# EAGLE design Horn_board_v2.1 (EAGLE 9.6.2)
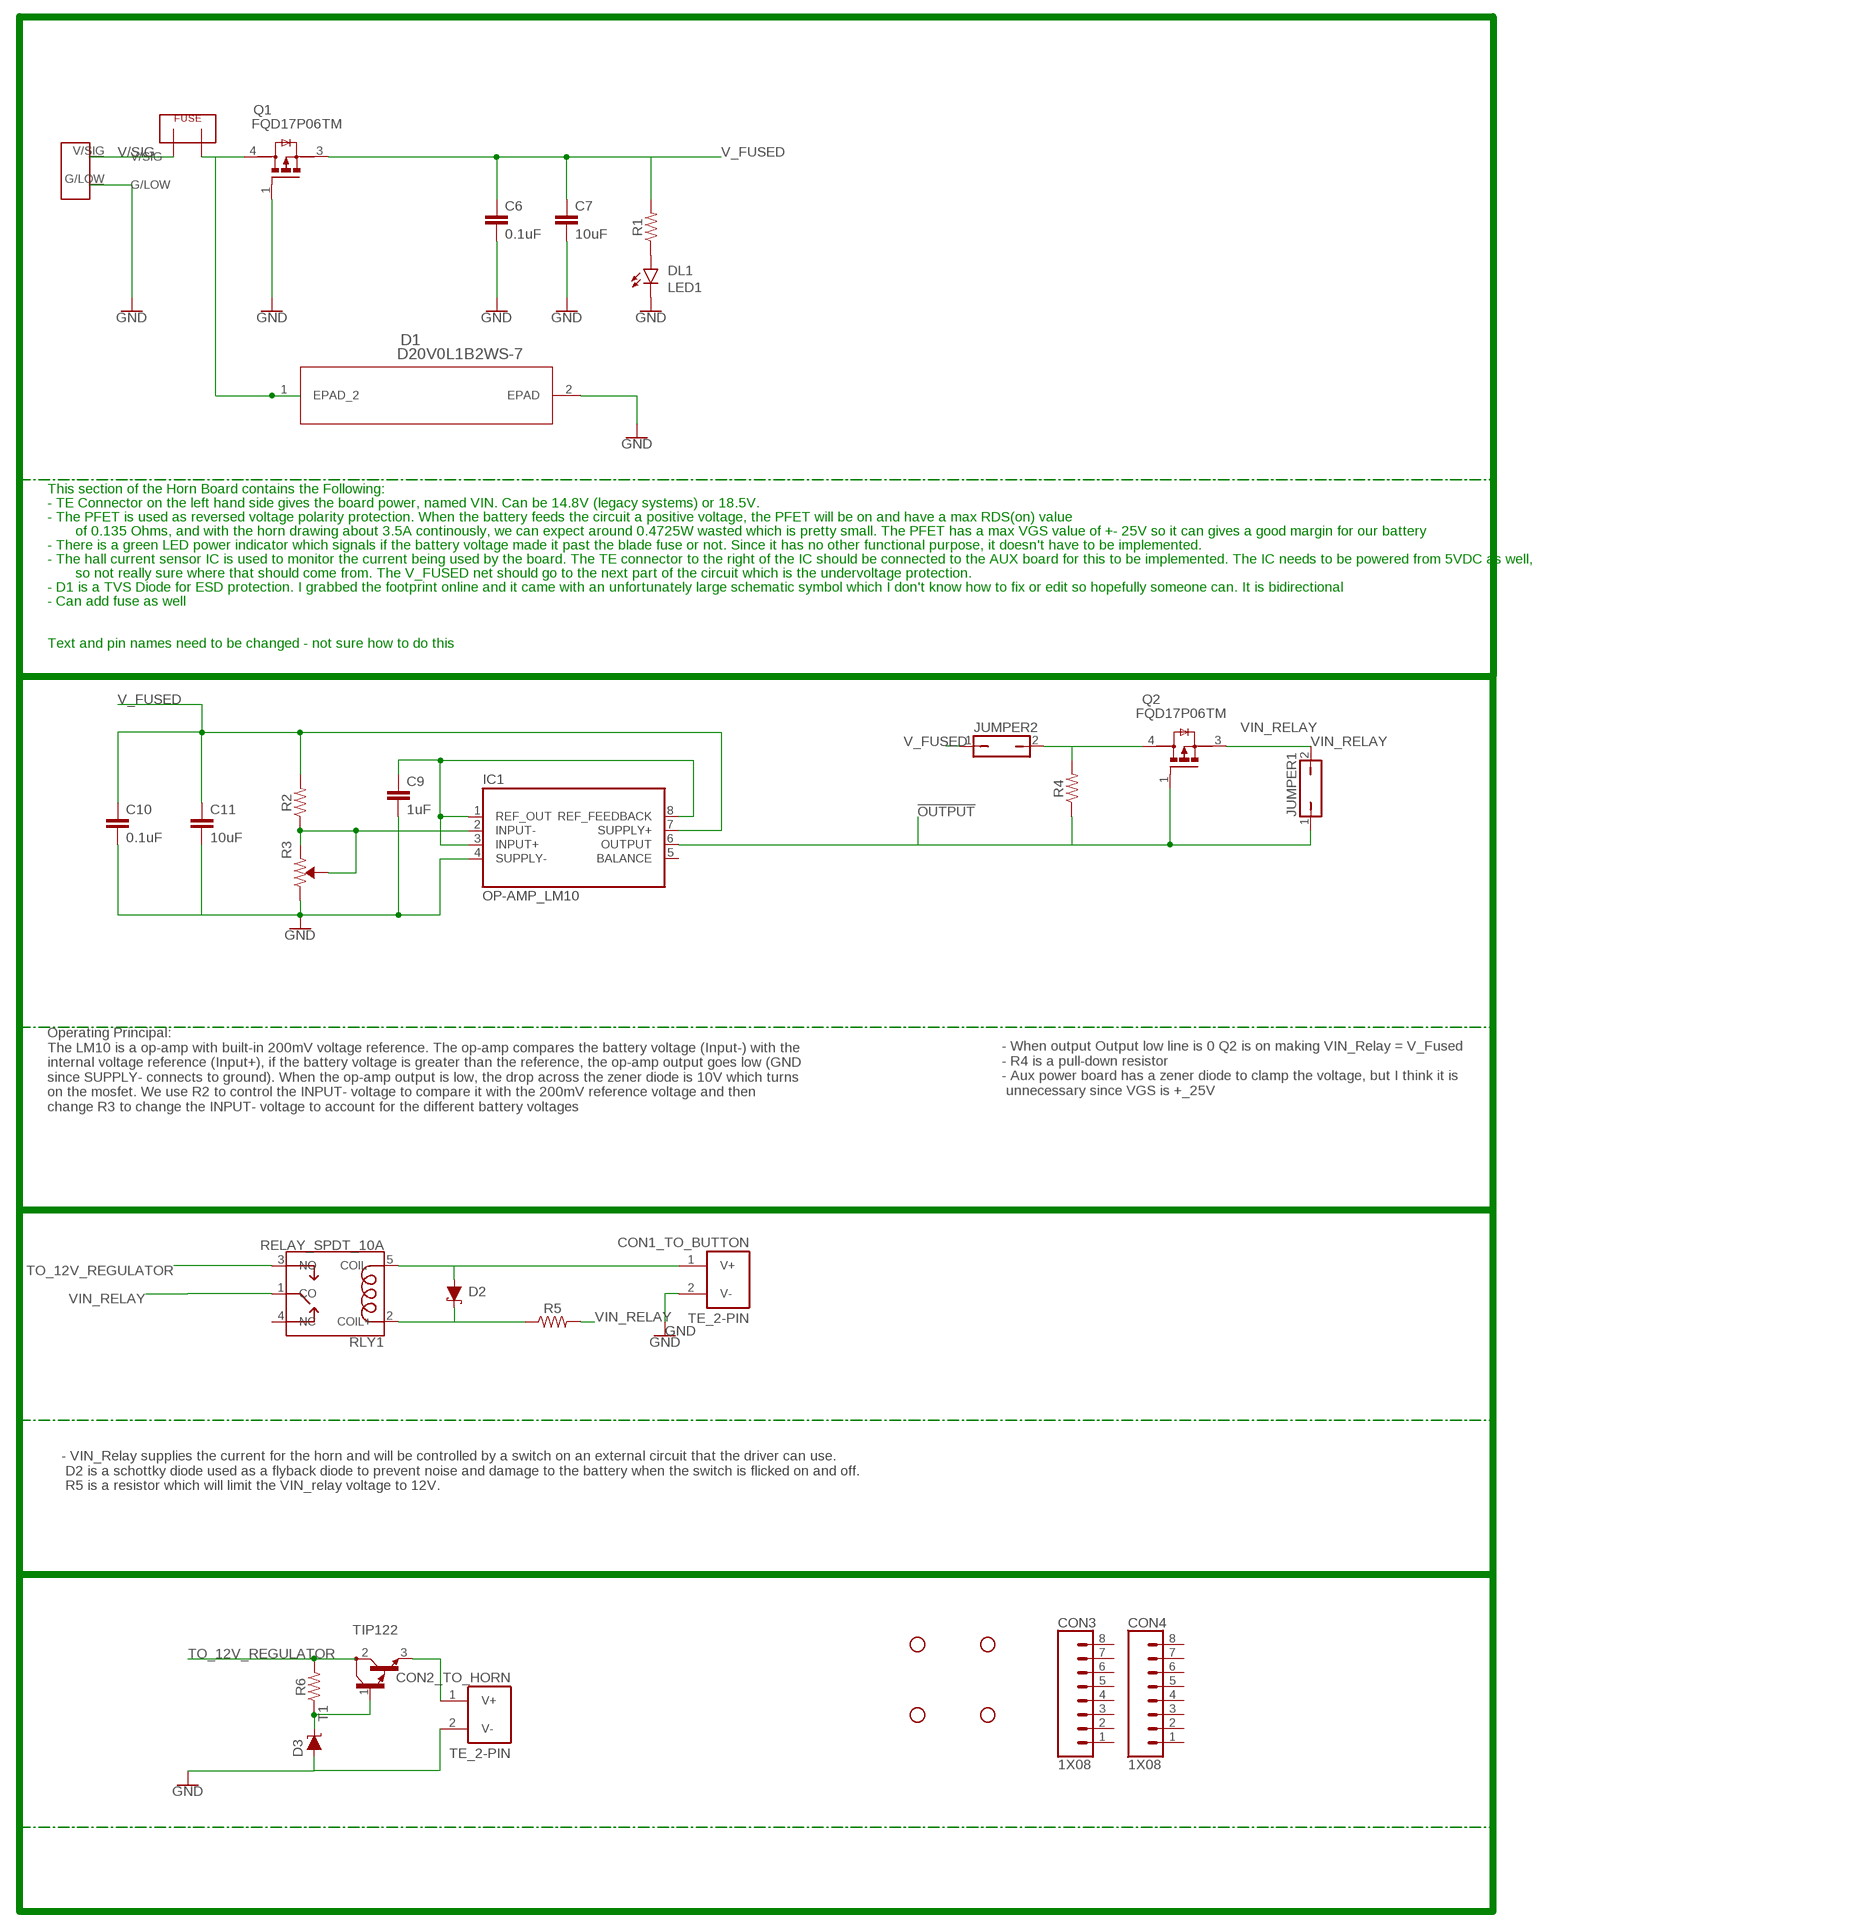
[diagram p0: schematic, sheet 1]

## Parts
C6  0.1uF  CAPACITOR_1210  [1210]
C7  10uF  CAPACITOR_1210  [1210]
C9  1uF  CAPACITOR_1210  [1210]
C10  0.1uF  CAPACITOR_1210  [1210]
C11  10uF  CAPACITOR_1210  [1210]
CON1_TO_BUTTON  TE_2-PIN  [TE_2-PIN]
CON2_TO_HORN  TE_2-PIN  [TE_2-PIN]
CON3  1X08  [1X08]
CON4  1X08  [1X08]
D1  D20V0L1B2WS-7  [SOD323_DIO]
D2  DIODE_SCHOTTKY_DO-214AA  [DO214AA]
D3  DIODE_TVS_DO-214AA  [DO214AA]
F2  FUSEMINI-BLADE  [MINI-BLADE-FUSE]
H1  STAND-OFF  [STAND-OFF]
H2  STAND-OFF  [STAND-OFF]
H3  STAND-OFF  [STAND-OFF]
H4  STAND-OFF  [STAND-OFF]
IC1  OP-AMP_LM10  [DIP08]
JUMPER1  JP1Q  [JP1]
JUMPER2  JP1Q  [JP1]
LED1  DL1  LED_0805  [0805_LED]
POWER_IN  2_PIN_TECONNECTOR  [2_PIN_CONNECT]
Q1  FQD17P06TM  [DPAK229P990X239-4N]
Q2  FQD17P06TM  [DPAK229P990X239-4N]
R1  RESISTOR_1210  [1210]
R2  RESISTOR_1210  [1210]
R3  RESISTOR_TRIMPOT  [TRIMPOT]
R4  RESISTOR_1210  [1210]
R5  RESISTOR_1210  [1210]
R6  RESISTOR_1210  [1210]
RLY1  RELAY_SPDT_10A  [RELAY_SPDT_10A]
T1  TIP122  [TO220]

## Nets
!OUTPUT: IC1.6(OUTPUT) JUMPER1.1 Q2.1(G) R4.1
GND: C6.2 C7.2 C10.2 C11.2 CON1_TO_BUTTON.2(V-) CON2_TO_HORN.2(V-) D1.2(EPAD) D3.A LED1.2(C) POWER_IN.G/LOW Q1.1(G) R3.3(CW)
N$2: C9.2 IC1.4(SUPPLY-)
N$4: RLY1.1(CO)
N$5: LED1.1(A) R1.1
N$6: IC1.2(INPUT-) R2.1 R3.1(CCW) R3.2(WIPER)
N$8: C9.1 IC1.1(REF_OUT) IC1.3(INPUT+) IC1.8(REF_FEEDBACK)
N$9: JUMPER2.2 Q2.4(D) R4.2
N$10: D2.C R5.1 RLY1.2(COIL+)
N$11: CON1_TO_BUTTON.1(V+) D2.A RLY1.5(COIL-)
N$13: D3.C R6.1 T1.1(B)
N$14: CON2_TO_HORN.1(V+) T1.3(E)
TO_12V_REGULATOR: R6.2 RLY1.3(NO) T1.2(C)
V/SIG: F2.OUT POWER_IN.V/SIG
V_FUSED: C6.1 C7.1 C10.1 C11.1 IC1.7(SUPPLY+) JUMPER2.1 Q1.3(S) R1.2 R2.2
VIN: D1.1(EPAD_2) F2.IN Q1.4(D)
VIN_RELAY: JUMPER1.2 Q2.3(S) R5.2
Unconnected: CON3.1 CON3.2 CON3.3 CON3.4 CON3.5 CON3.6 CON3.7 CON3.8 CON4.1 CON4.2 CON4.3 CON4.4 CON4.5 CON4.6 CON4.7 CON4.8 IC1.5(BALANCE) RLY1.4(NC)

## Notes on the sheet
- This section of the Horn Board contains the Following:
- - TE Connector on the left hand side gives the board power, named VIN. Can be 14.8V (legacy systems) or 18.5V.
- - The PFET is used as reversed voltage polarity protection. When the battery feeds the circuit a positive voltage, the PFET will be on and have a max RDS(on) value
- of 0.135 Ohms, and with the horn drawing about 3.5A continously, we can expect around 0.4725W wasted which is pretty small. The PFET has a max VGS value of +- 25V so it can gives a good margin for our battery
- - There is a green LED power indicator which signals if the battery voltage made it past the blade fuse or not. Since it has no other functional purpose, it doesn't have to be implemented.
- - The hall current sensor IC is used to monitor the current being used by the board. The TE connector to the right of the IC should be connected to the AUX board for this to be implemented. The IC needs to be powered from 5VDC as well,
- so not really sure where that should come from. The V_FUSED net should go to the next part of the circuit which is the undervoltage protection.
- - D1 is a TVS Diode for ESD protection. I grabbed the footprint online and it came with an unfortunately large schematic symbol which I don't know how to fix or edit so hopefully someone can. It is bidirectional
- - Can add fuse as well
- Text and pin names need to be changed - not sure how to do this
- - When output Output low line is 0 Q2 is on making VIN_Relay = V_Fused
  - R4 is a pull-down resistor 
  - Aux power board has a zener diode to clamp the voltage, but I think it is
   unnecessary since VGS is +_25V
- Operating Principal: 
  The LM10 is a op-amp with built-in 200mV voltage reference. The op-amp compares the battery voltage (Input-) with the 
  internal voltage reference (Input+), if the battery voltage is greater than the reference, the op-amp output goes low (GND 
  since SUPPLY- connects to ground). When the op-amp output is low, the drop across the zener diode is 10V which turns 
  on the mosfet. We use R2 to control the INPUT- voltage to compare it with the 200mV reference voltage and then 
  change R3 to change the INPUT- voltage to account for the different battery voltages
- - VIN_Relay supplies the current for the horn and will be controlled by a switch on an external circuit that the driver can use. 
   D2 is a schottky diode used as a flyback diode to prevent noise and damage to the battery when the switch is flicked on and off.
   R5 is a resistor which will limit the VIN_relay voltage to 12V.

## Library data of the parts
C6 C7 C9-C11 = EcoCar-Passives:CAPACITOR_1210
CON1_TO_BUTTON CON2_TO_HORN = EcoCar-Connectors:TE_2-PIN: 2 Pin TE Mini-Universal MATE-N-LOK - Use for signals and power connections Part Number: 1-770966-0 Digikey Part Number: A32471-ND Matching Plug: A25587-ND Matching Crimps: A100828CT-ND
CON3 CON4 = EcoCar-Connectors-2.54mm:1X08: 2.54mm (0.1") Header
D1 = TVS Diode - 20V:D20V0L1B2WS-7: TVS Diode 20V - Bidirectional; BUILT_BY: EMA_UL_Team; MANUFACTURER_PART_NUMBER: D20V0L1B2WS-7; SOURCELIBRARY: DIODESINC_2_2015-08-18; VENDOR: Diodes Inc
D2 = EcoCar-Discrete-Semiconductors:DIODE_SCHOTTKY_DO-214AA
D3 = EcoCar-Fuses-Protection:DIODE_TVS_DO-214AA
F2 = Fuse:FUSE
H1-H4 = EcoCar-Miscellaneous:STAND-OFF: Stand Off Drill holes for mechanically mounting via screws, standoffs, etc. Note: Use the keepout ring to avoid running the screw head into surrounding components. Variant Overviews STAND-OFF - Mechanical footprint for a #4 phillips button head screw. STAND-OFF-TIGHT - Mechanical footprint for a #4 phillips button head screw, Example SparkFun Products Screw - Phillips Head (1/4", 4-40, 10 pack) <https://www.sparkfun.com/products/10453> (PRT-10453) Screw - Phillips Head (1/2", 4-40, 10 pack) <https://www.sparkfun.com/products/10452> (PRT-10452) Screw - Phillips Head (3/4", 4-40, 10 pack) <https://www.sparkfun.com/products/10451> (PRT-10451) Screw - Phillips Head (1", 4-40, 10 pack) <https://www.sparkfun.com/products/10450> (PRT-10450)
IC1 = EcoCar-Integrated-Circuits:OP-AMP_LM10: Op-Amp with Internal Voltage Reference Manufacturer: Texas Instruments Part Number: LM10CN/NOPB Digikey Part Number: LM10CN/NOPB-ND
JUMPER1 JUMPER2 = jumper:JP1Q: JUMPER
LED1 = EcoCar-Discrete-Semiconductors:LED_0805
POWER_IN = TE 2-pin connector:2_PIN_TECONNECTOR: 2-pin connector for high power connections on board
Q1 Q2 = PFET - Reverse Polarity Protection:FQD17P06TM: Transistor: P-MOSFET; unipolar; 60V; 7.6A; 44W; DPAK; QFET®; MANUFACTURER: ON Semiconductor; PARTREV: C3; SNAPEDA_PACKAGE_ID: 35066; STANDARD: IPC7351B
R1 R2 R4-R6 = EcoCar-Passives:RESISTOR_1210
R3 = EcoCar-Passives:RESISTOR_TRIMPOT: Bourns Trimpot Example Part: 10k trimpot Manufacturer: Bourns Part Number: PV36W103C01B00 Digikey Part Number: 490-2875-ND
RLY1 = EcoCar-Electromechanical:RELAY_SPDT_10A: 10A SPDT Relay Manufacturer: Omron Part Number: G5LE-1-VDDC12 Digikey Part Number: Z3672-ND Ratings: 12VDC coil voltage 33.3mA coil current 250VAC/125VDC switching voltage 10A contact rating
T1 = transistor:TIP122: NPN BIPOLAR DARLINGTON TRANSISTOR

## Board
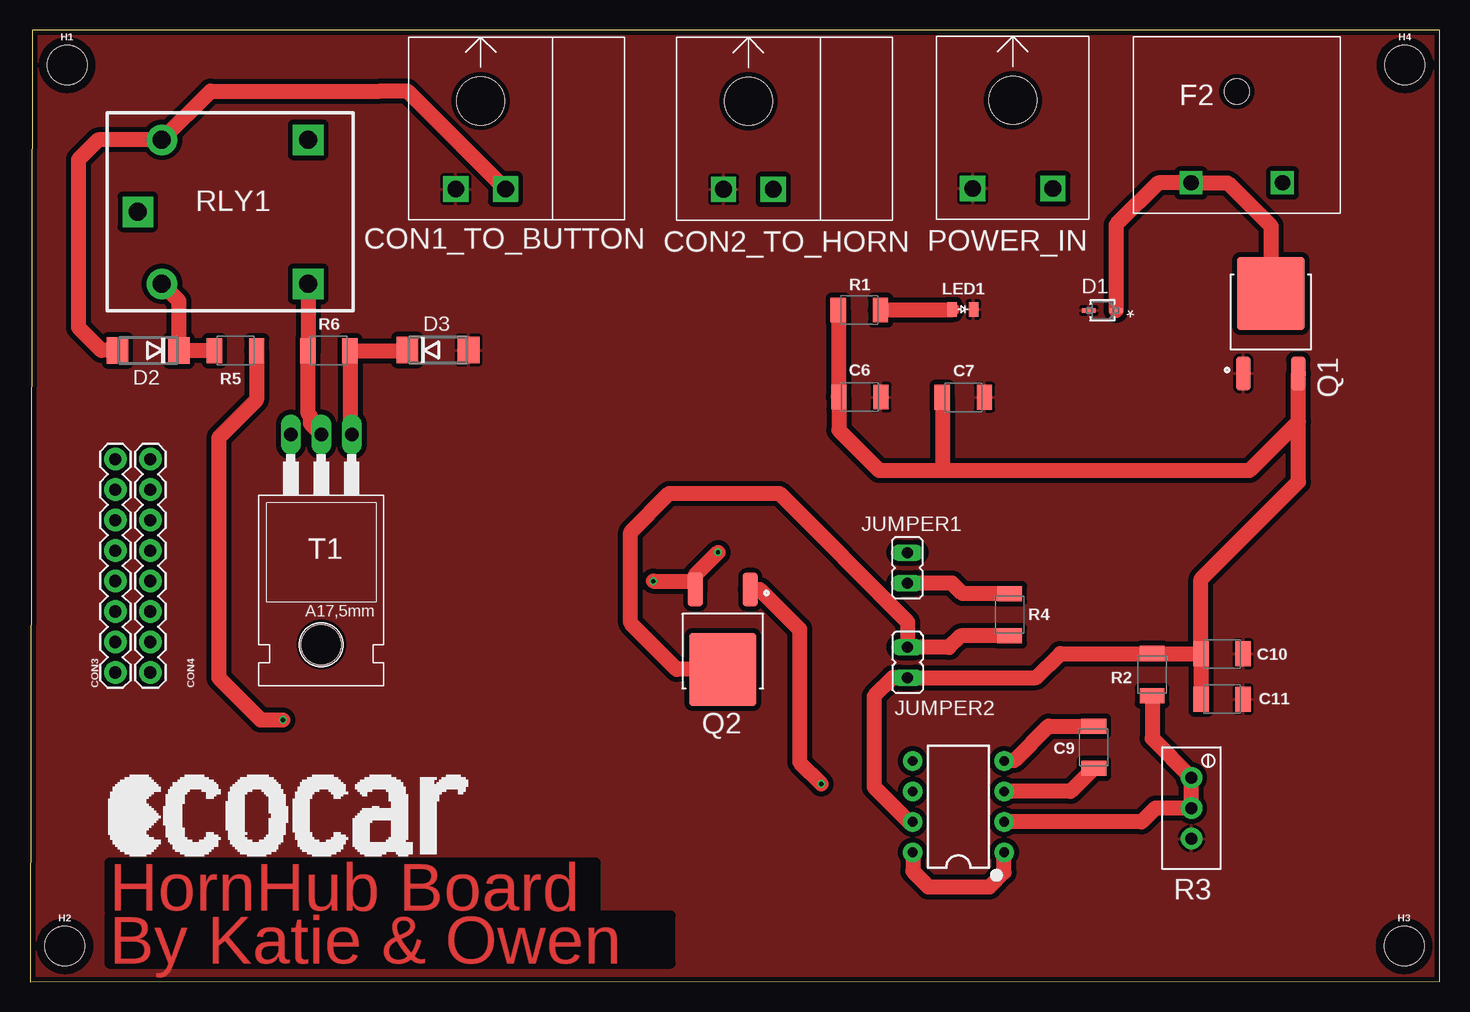
[diagram p1: board, top side]
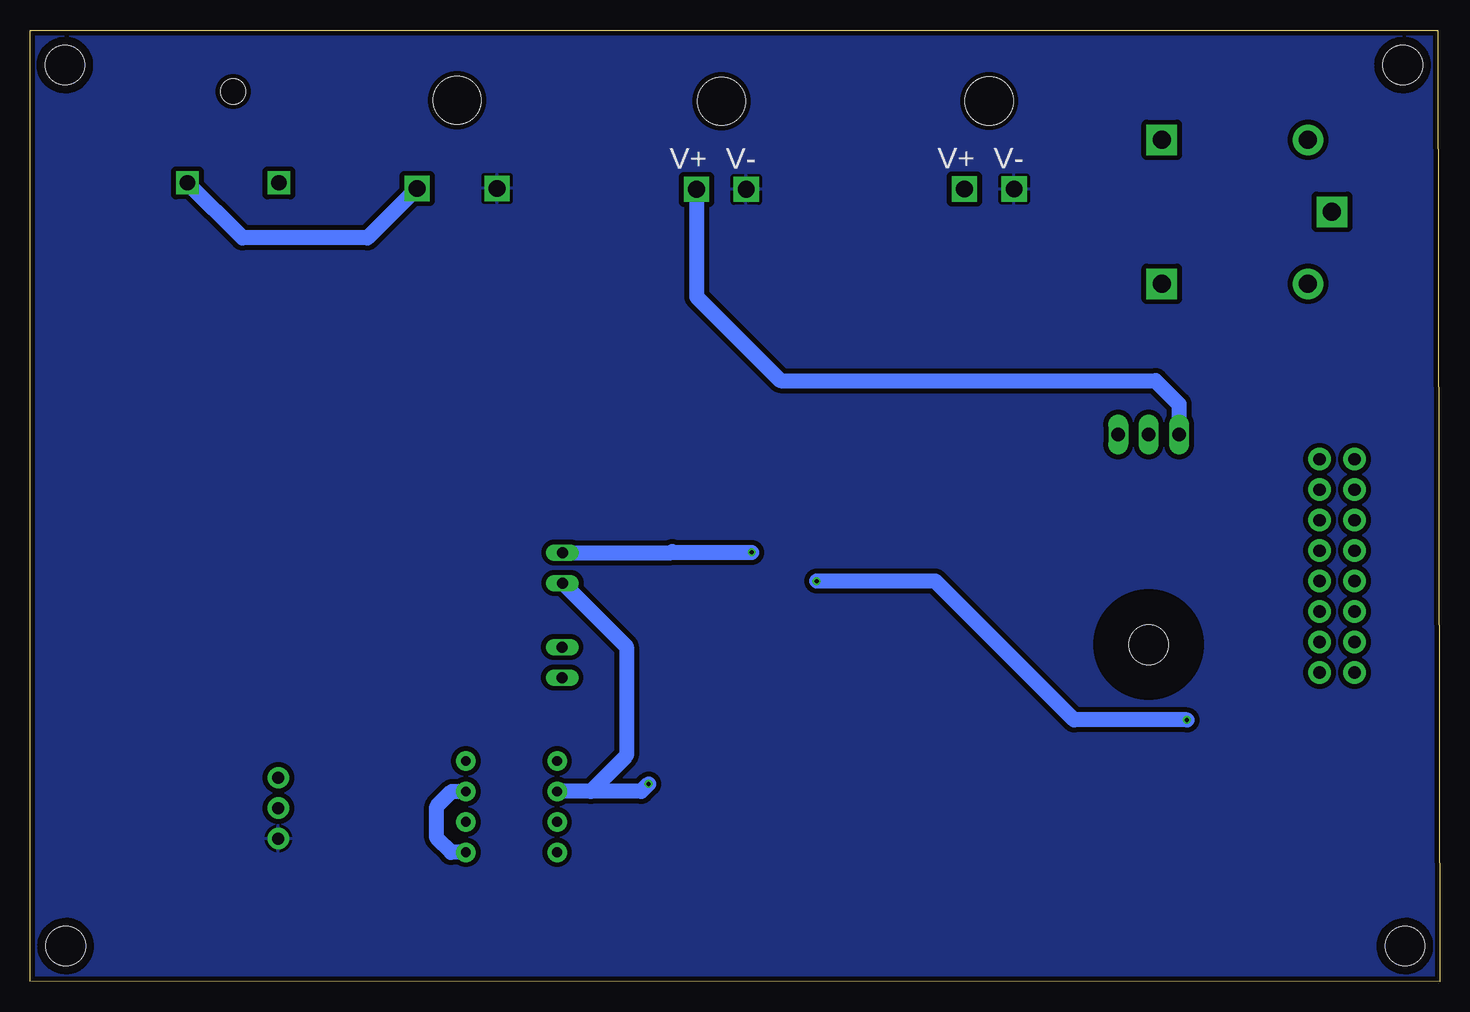
[diagram p2: board, bottom side, seen from below]

Size 117.53 x 79.31 mm. Coordinates in mm from the lower left corner, seen from the top.
Outline: 0,0 117.51,0.05 117.53,79.29 0.19,79.31 0,0
Copper layers (1*2*15*16): Top 0.035mm / dielectric 0.1702mm / Route2 0.0175mm / dielectric 47mil / Route15 0.0175mm / dielectric 0.1702mm / Bottom 0.035mm
Design rules "JLCPCB4Layer": minimum track width 6mil, minimum drill 10mil, track to track 6mil, track to pad 6mil, pad to pad 6mil, via to via 6mil, smd to smd 0mil, copper to edge 10mil, drill to drill 10mil, minimum pad ring 6mil, minimum via ring 6mil, stop-mask expansion 2mil, vias tented up to drill 100mil, thermal gap 10mil

### Footprints (pad centres in the part's own frame; a part is rotated, then mirrored left to right if it is on the bottom)
1210 = smd 1.27 x 2.06: 1 -1.755,0; 2 1.755,0
TE_2-PIN = drill 1.4 square: 1 -2.07,12.67; 2 2.07,12.67 | hole 4: 0,5.33
1X08 = drill 1.016 pad 1.88: 1 0,0; 2 2.54,0; 3 5.08,0; 4 7.62,0; 5 10.16,0; 6 12.7,0; 7 15.24,0; 8 17.78,0
SOD323_DIO = smd 1.111 x 0.401: 1 -1.15,0; 2 1.15,0
DO214AA = smd 1.8 x 2.2: A 2.55,0; C -2.55,0
MINI-BLADE-FUSE = drill 1.27 square: IN 3.81,7.62; OUT -3.81,7.62 | hole 2.083: 0,0
STAND-OFF = hole 3.302: 0,0
DIP08 = drill 0.813 pad 1.626: 1 -3.81,-3.81; 2 -1.27,-3.81; 3 1.27,-3.81; 4 3.81,-3.81; 5 3.81,3.81; 6 1.27,3.81; 7 -1.27,3.81; 8 -3.81,3.81
JP1 = drill 0.914 long: 1 0,-1.27; 2 0,1.27
0805_LED = smd 0.8 x 1.2: 1 -0.9,0; 2 0.9,0
2_PIN_CONNECT = drill 1.4 square: G/LOW 3.34,12.67; V/SIG -3.34,12.67 | hole 4: 0,5.33
DPAK229P990X239-4N = smd 1.22 x 2.83: 1 -2.29,-4.14; 3 2.29,-4.14 | smd 5.63 x 6.1: 4 0,2.51
TRIMPOT = drill 1 pad 1.778: 1 5.08,0; 2 2.54,0; 3 0,0
RELAY_SPDT_10A = drill 1.5 pad 2.55 square: 1 0,0; 3 14.2,-6; 4 14.2,6 | drill 1.5 pad 2.55: 2 2,-6; 5 2,6
TO220 = drill 1.118 long: 1 -2.54,-6.35; 2 0,-6.35; 3 2.54,-6.35 | hole 3.302: 0,11.176

### Placement (x,y rotation side)
C6  69.19,48.72 0 top
C7  77.8,48.7 0 top
C9  88.68,19.55 90 top
C10  99.38,27.33 0 top
C11  99.38,23.55 0 top
CON1_TO_BUTTON  37.57,78.73 180 top
CON2_TO_HORN  59.89,78.7 180 top
CON3  7.11,25.77 90 top
CON4  10.03,25.77 90 top
D1  89.41,55.94 180 top
D2  9.86,52.6 180 top
D3  34.01,52.64 0 top
F2  100.6,74.19 180 top
H1  3.1,76.39 0 top
H2  2.91,2.97 0 top
H3  114.55,2.97 0 top
H4  114.62,76.39 0 top
IC1  77.39,14.59 90 top
JUMPER1  73.14,34.49 0 top
JUMPER2  73.16,26.61 0 top
LED1  77.76,56.03 0 top
POWER_IN  81.93,78.78 180 top
Q1  103.44,54.84 0 top
Q2  57.75,28.54 180 top
R1  69.14,55.97 180 top
R2  93.55,25.59 90 top
R3  96.82,11.93 90 top
R4  81.67,30.58 270 top
R5  17.13,52.59 0 top
R6  24.92,52.59 180 top
RLY1  8.99,64.16 0 top
T1  24.28,39.27 180 top

### Tracks (layer width: path | path; a pad name or v marks a point on that pad's centre or on a via)
!OUTPUT  (via drill 0.35)
  Top 1.27: R4.1 77.75,32.34 76.86,33.22 JUMPER1.1 | Q2.1 60.85,32.68 64.15,29.38 64.15,18.3 v65.96,16.48
  Bottom 1.27: JUMPER1.1 73.1,33.22 67.81,27.93 67.81,18.83 70.78,15.86 IC1.6 66.59,15.86 v65.96,16.48
GND
  pour Top (isolate 0.406): -0.43,80.95 118.9,80.95 118.9,77.47 118.85,77.42 118.85,-0.83 -0.43,-0.83
  pour Bottom (isolate 0.406): -0.9,82.08 118.43,82.08 118.43,-0.51 -0.9,-0.51
N$2
  Top 1.27: IC1.4 81.23,18.43 82.04,18.43 84.92,21.3 C9.2
N$5
  Top 1.27: LED1.1 76.8,55.97 R1.1
N$6
  Top 1.27: R2.1 93.55,20.28 R3.1 R3.2 93.83,14.47 92.68,13.32 IC1.2
N$8
  Top 1.27: C9.1 86.75,15.86 IC1.3 | IC1.8 73.58,9.22 74.89,7.91 80.01,7.91 81.2,9.11 IC1.1
  Bottom 1.27: IC1.1 82.44,10.78 83.62,11.96 83.62,14.62 82.37,15.86 IC1.3
N$9
  Top 1.27: R4.2 77.58,28.83 76.62,27.86 73.18,27.86 JUMPER2.2 73.16,30 62.47,40.69 53.28,40.69 50.06,37.48 50.06,29.88 53.91,26.03 Q2.4
N$10
  Top 1.27: RLY1.2 12.4,56.75 D2.C 15.36,52.6 R5.1
N$11
  Top 1.27: D2.A 5.94,52.6 4.03,54.52 4.03,68.52 5.67,70.16 RLY1.5 15.05,74.22 29.2,74.22 31.47,74.22 CON1_TO_BUTTON.1
N$13
  Top 1.27: T1.1 26.67,45.77 R6.1 31.41,52.59 D3.C
N$14
  Bottom 1.27: CON2_TO_HORN.1 61.96,57.07 54.98,50.09 23.7,50.09 21.74,48.13 T1.3
TO_12V_REGULATOR
  Top 1.27: T1.2 23.37,46.53 23.37,47.13 23.19,47.31 23.19,52.56 | 23.19,52.56 R6.2 | RLY1.3 23.19,52.56
V/SIG
  Bottom 1.27: POWER_IN.V/SIG 89.39,61.99 99.82,61.99 F2.OUT
V_FUSED
  Top 1.27: R1.2 67.38,48.77 C6.1 67.43,45.98 67.42,45.97 70.79,42.61 76.05,42.61 | 105.73,46.67 Q1.3 | 105.73,46.67 101.67,42.61 76.05,42.61 | C10.1 97.61,27.35 R2.2 85.88,27.35 83.87,25.34 JUMPER2.1 71.92,25.34 70.36,23.77 70.36,16.23 73.27,13.32 IC1.7 | C10.1 C11.1 | C10.1 97.62,33.55 105.73,41.66 105.73,46.67 | C7.1 76.05,42.61
VIN
  Top 1.27: D1.1 90.53,55.97 90.53,63.06 94.04,66.57 F2.IN 99.85,66.57 103.44,62.98 Q1.4
VIN_RELAY  (via drill 0.35)
  Top 1.27: v57.37,35.79 55.46,33.88 55.46,33.38 | 55.46,33.38 Q2.3 | R5.2 18.89,48.49 15.74,45.34 15.74,25.32 19.23,21.83 21.07,21.83 v21.08,21.82 | v51.96,33.38 55.46,33.38
  Bottom 1.27: JUMPER1.2 64.06,35.76 63.97,35.85 63.91,35.79 v57.37,35.79 | v21.08,21.82 30.49,21.82 42.07,33.4 51.93,33.4 v51.96,33.38

### Text on the board
Top: HornHub Board | By Katie & Owen
tPlace: POWER_IN